# Altium schematic sheet Main.SchDoc
size A3; SheetNumber: 1; SheetTotal: 7
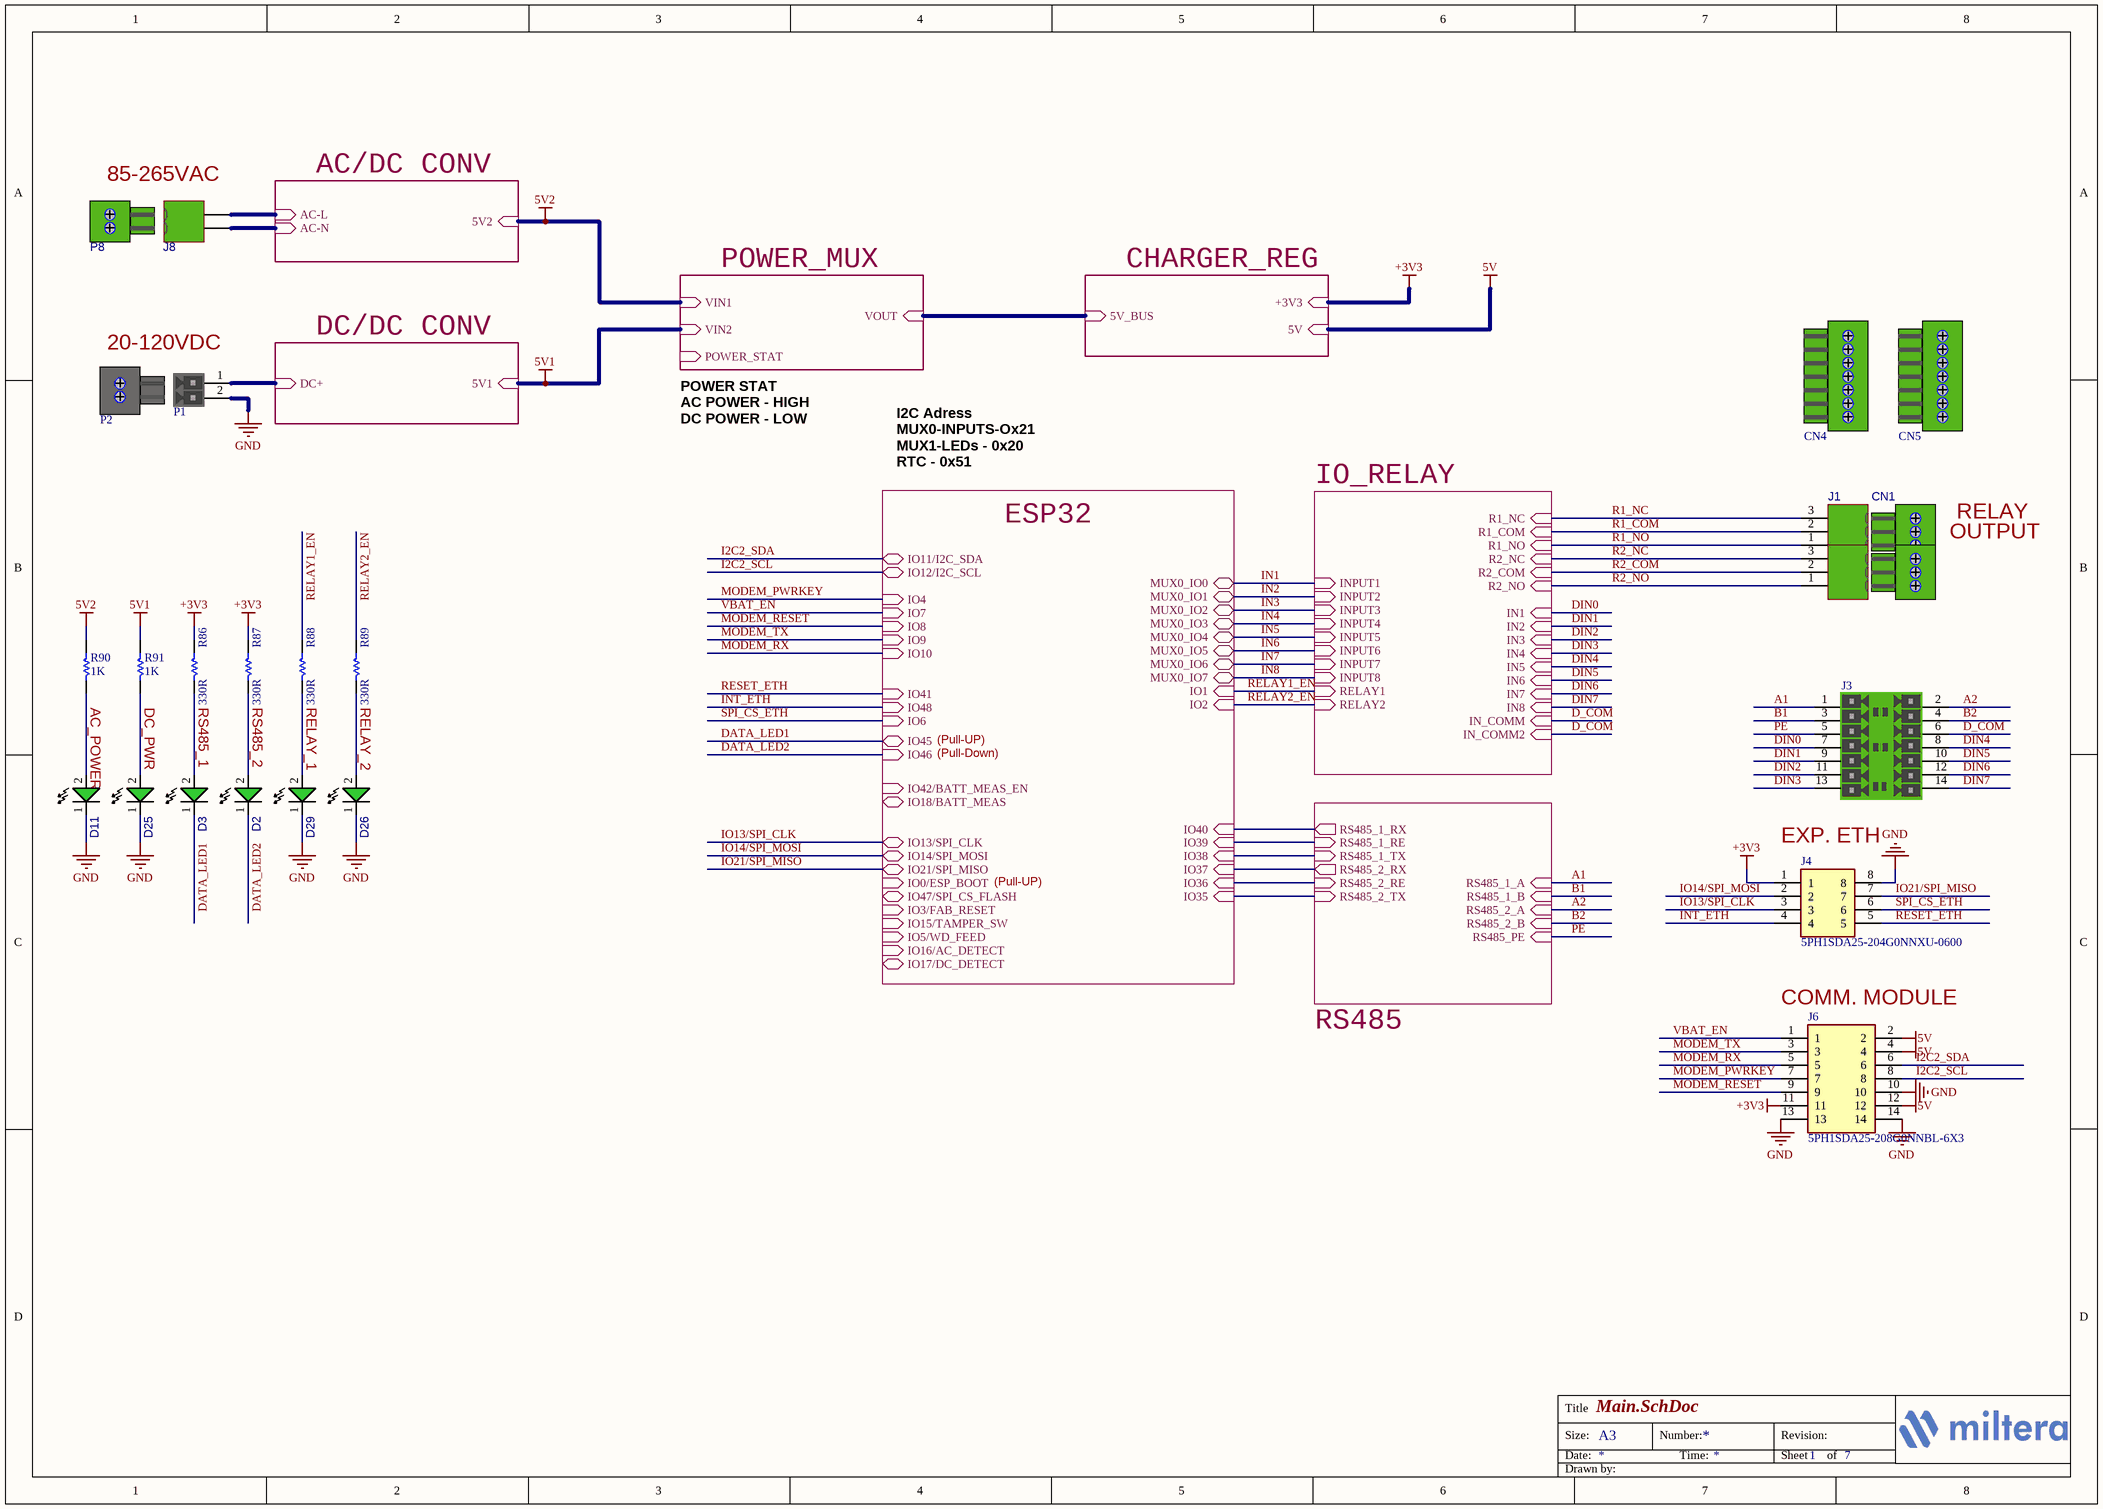
[diagram p0: Main.SchDoc]

## Parts
CN1  2EDGK-5.08-06P-14-00AH  [2EDGK-5.08-06P-14-00AH]  (value not drawn)  (mechanical)
CN2  2EDGRC-5.08-03P-14-00SH  [2EDGRC-5.08-03P-14-00SH]  (value not drawn)  (no BOM)
CN3  2EDGK-5.08-03P-14-00AH  [2EDGK-5.08-06P-14-00AH]  (value not drawn)  (no BOM)
CN4  15EDGK-3.81-07P-14-00AH  [15EDGK-3.81-07P]  (value not drawn)
CN5  15EDGK-3.81-07P-14-00AH  [15EDGK-3.81-07P]  (value not drawn)
D2  PSC-1608U52GC-G4  [LED_0603_GRN]  (value not drawn)
D3  PSC-1608U52GC-G4  [LED_0603_GRN]  (value not drawn)
D11  PSC-1608U52GC-G4  [LED_0603_GRN]  (value not drawn)
D25  PSC-1608U52GC-G4  [LED_0603_GRN]  (value not drawn)
D26  PSC-1608U52GC-G4  [LED_0603_GRN]  (value not drawn)
D29  PSC-1608U52GC-G4  [LED_0603_GRN]  (value not drawn)
J1  2EDGRC-5.08-06P-14-00SH  [2EDGRC-5.08-03P-14-00SH]  (value not drawn)
J3  15EDGRH-3.81-12P-14-00AH  [15EDGRH-3.81-14P]  (value not drawn)
J4  5PH1SDA25-204G0NNXU-0600  [61300821121]
J6  5PH1SDA25-208G0NNBL-6X3  [HDRV14W64P254_2X7_1778X508X854P]
J8  2EDGRC-5.08-02P-14-00AH  [2EDGRC-5.08-02P]  (value not drawn)
P1  15EDGRC-3.5-02P-11-00AH  [15EDGRC-3.5-02P-11-00AH]  (value not drawn)
P2  15EDGK-3.5-02P-11-00AH  [15EDGK-3.5-02P-11-00AH]  (value not drawn)
P8  2EDGK-5.08-02P-14-00AH  [2EDGK-5.08-02P]  (value not drawn)
R86  value 330R  [RES_0603]  (hidden comment: RES)
R87  value 330R  [RES_0603]  (hidden comment: RES)
R88  value 330R  [RES_0603]  (hidden comment: RES)
R89  value 330R  [RES_0603]  (hidden comment: RES)
R90  value 1K  [RES_0603]  (hidden comment: RES)
R91  value 1K  [RES_0603]  (hidden comment: RES)

## Sub-sheets
AC/DC CONV = ACDC.SchDoc: AC-L (in), AC-N (in), 5V2 (in)
CHARGER_REG = Charger_S.CAP_BAT.SchDoc: 5V_BUS (in), +3V3 (in), 5V (in)
DC/DC CONV = DC_EXT.SchDoc: DC+ (in), 5V1 (in)
ESP32 = ESP32.SchDoc: IO35 (in), IO36 (in), IO37 (in), IO38 (in), IO39 (in), IO40 (in), IO11/I2C_SDA (bidir), IO12/I2C_SCL (bidir), IO16/AC_DETECT (in), IO15/TAMPER_SW (in), IO5/WD_FEED (in), IO3/FAB_RESET (in), IO0/ESP_BOOT (in), IO47/SPI_CS_FLASH (bidir), IO13/SPI_CLK (bidir), IO14/SPI_MOSI (bidir), IO21/SPI_MISO (bidir), IO1 (in), IO2 (in), IO42/BATT_MEAS_EN (in), IO41 (in), IO48 (in), IO10 (in), IO9 (in), IO46 (in), IO8 (in), IO7 (in), IO4 (in), IO17/DC_DETECT (bidir), IO18/BATT_MEAS (bidir), IO6 (in), MUX0_IO0 (bidir), MUX0_IO1 (bidir), MUX0_IO2 (bidir), MUX0_IO3 (bidir), MUX0_IO4 (bidir), MUX0_IO5 (bidir), MUX0_IO6 (bidir), MUX0_IO7 (bidir), IO45 (bidir)
IO_RELAY = IO.SchDoc: INPUT1 (in), INPUT2 (in), INPUT3 (in), INPUT4 (in), RELAY1 (in), RELAY2 (in), R1_COM (in), R1_NO (in), R2_COM (in), R2_NO (in), R1_NC (in), R2_NC (in), IN1 (in), IN2 (in), IN3 (in), IN4 (in), IN_COMM (in), IN5 (in), IN6 (in), IN7 (in), IN8 (in), IN_COMM2 (in), INPUT5 (in), INPUT6 (in), INPUT7 (in), INPUT8 (in)
POWER_MUX = POWER_MUX.SchDoc: VIN1 (in), VIN2 (in), VOUT (in), POWER_STAT (in)
RS485 = RS485.SchDoc: RS485_1_B (in), RS485_1_A (in), RS485_2_B (in), RS485_2_A (in), RS485_1_RX (out), RS485_1_RE (in), RS485_1_TX (in), RS485_2_RX (out), RS485_2_RE (in), RS485_2_TX (in), RS485_PE (in)

## Nets
5V: J6.2 J6.4 J6.12 ; sheet CHARGER_REG/5V
5V1: R91.1 ; sheet DC/DC CONV/5V1, sheet POWER_MUX/VIN2
5V2: R90.1 ; sheet AC/DC CONV/5V2, sheet POWER_MUX/VIN1
+3V3: J4.1 J6.11 R86.1 R87.1 ; sheet CHARGER_REG/+3V3
GND: D11.1 D25.1 D26.1 D29.1 J4.8 J6.10 J6.13 J6.14 P1.2
A1: J3.1 ; sheet RS485/RS485_1_A
A2: J3.2 ; sheet RS485/RS485_2_A
B1: J3.3 ; sheet RS485/RS485_1_B
B2: J3.4 ; sheet RS485/RS485_2_B
D_COM: J3.6 ; sheet IO_RELAY/IN_COMM, sheet IO_RELAY/IN_COMM2
DATA_LED1: D3.1 ; sheet ESP32/IO45
DATA_LED2: D2.1 ; sheet ESP32/IO46
DIN0: J3.7 ; sheet IO_RELAY/IN1
DIN1: J3.9 ; sheet IO_RELAY/IN2
DIN2: J3.11 ; sheet IO_RELAY/IN3
DIN3: J3.13 ; sheet IO_RELAY/IN4
DIN4: J3.8 ; sheet IO_RELAY/IN5
DIN5: J3.10 ; sheet IO_RELAY/IN6
DIN6: J3.12 ; sheet IO_RELAY/IN7
DIN7: J3.14 ; sheet IO_RELAY/IN8
I2C2_SCL: J6.8 ; sheet ESP32/IO12/I2C_SCL
I2C2_SDA: J6.6 ; sheet ESP32/IO11/I2C_SDA
IN1: sheet ESP32/MUX0_IO0, sheet IO_RELAY/INPUT1
IN2: sheet ESP32/MUX0_IO1, sheet IO_RELAY/INPUT2
IN3: sheet ESP32/MUX0_IO2, sheet IO_RELAY/INPUT3
IN4: sheet ESP32/MUX0_IO3, sheet IO_RELAY/INPUT4
IN5: sheet ESP32/MUX0_IO4, sheet IO_RELAY/INPUT5
IN6: sheet ESP32/MUX0_IO5, sheet IO_RELAY/INPUT6
IN7: sheet ESP32/MUX0_IO6, sheet IO_RELAY/INPUT7
IN8: sheet ESP32/MUX0_IO7, sheet IO_RELAY/INPUT8
INT_ETH: J4.4 ; sheet ESP32/IO48
IO13/SPI_CLK: J4.3 ; sheet ESP32/IO13/SPI_CLK
IO14/SPI_MOSI: J4.2 ; sheet ESP32/IO14/SPI_MOSI
IO21/SPI_MISO: J4.7 ; sheet ESP32/IO21/SPI_MISO
MODEM_PWRKEY: J6.7 ; sheet ESP32/IO4
MODEM_RESET: J6.9 ; sheet ESP32/IO8
MODEM_RX: J6.5 ; sheet ESP32/IO10
MODEM_TX: J6.3 ; sheet ESP32/IO9
PE: J3.5 ; sheet RS485/RS485_PE
R1_COM: J1.2 ; sheet IO_RELAY/R1_COM
R1_NC: J1.3 ; sheet IO_RELAY/R1_NC
R1_NO: J1.1 ; sheet IO_RELAY/R1_NO
R2_COM: CN2.2 ; sheet IO_RELAY/R2_COM
R2_NC: CN2.3 ; sheet IO_RELAY/R2_NC
R2_NO: CN2.1 ; sheet IO_RELAY/R2_NO
RELAY1_EN: R88.1 ; sheet ESP32/IO1, sheet IO_RELAY/RELAY1
RELAY2_EN: R89.1 ; sheet ESP32/IO2, sheet IO_RELAY/RELAY2
RESET_ETH: J4.5 ; sheet ESP32/IO41
SPI_CS_ETH: J4.6 ; sheet ESP32/IO6
VBAT_EN: J6.1 ; sheet ESP32/IO7
NetD2_2: D2.2 R87.2
NetD3_2: D3.2 R86.2
NetD11_2: D11.2 R90.2
NetD25_2: D25.2 R91.2
NetD26_2: D26.2 R89.2
NetD29_2: D29.2 R88.2
NetJ8_1: J8.1 ; sheet AC/DC CONV/AC-L
NetJ8_2: J8.2 ; sheet AC/DC CONV/AC-N
NetP1_1: P1.1 ; sheet DC/DC CONV/DC+
(unnamed): sheet ESP32/IO35, sheet RS485/RS485_2_TX
(unnamed): sheet ESP32/IO36, sheet RS485/RS485_2_RE
(unnamed): sheet ESP32/IO37, sheet RS485/RS485_2_RX
(unnamed): sheet ESP32/IO38, sheet RS485/RS485_1_TX
(unnamed): sheet ESP32/IO39, sheet RS485/RS485_1_RE
(unnamed): sheet ESP32/IO40, sheet RS485/RS485_1_RX
(unnamed): sheet POWER_MUX/VOUT, sheet CHARGER_REG/5V_BUS

## Notes on the sheet
- (near J8) 85-265VAC
- (near P1) 20-120VDC
- POWER STAT
  AC POWER - HIGH
  DC POWER - LOW
- I2C Adress
  MUX0-INPUTS-Ox21
  MUX1-LEDs - 0x20
  RTC - 0x51
- OUTPUT
- RELAY
- AC_POWER
- DC_PWR
- RS485_1
- RS485_2
- RELAY_1
- RELAY_2
- (Pull-Down)
- (Pull-UP)
- EXP. ETH
- (near J6) COMM. MODULE
- Title
- Size:
- Date:
- A3
- Number:
- Time:
- Revision:
- Sheet
- of
- Drawn by:

## Library data of the parts
CN1 = 2EDGK-5.08-03P-14-00AH: TERM.BLK.5.08MM 6P FEMALE GREEN; Manufacturer: DEGSON; Manufacturer Part Number: 2EDGK-5.08-06P-14-00AH; Value: 2EDGK-5.08-06P-14-00AH
CN2 = 2EDGRC-5.08-03P-14-00SH: TERM.BLK.5.08MM 3P 90C MALE GREEN CLOSED; Manufacturer: GAOSONG; Package: *; Manufacturer Part Number: 2EDGRC-5.08-03P-14-00SH; Value: 2EDGRC-5.08-03P-14-00SH
CN3 = 2EDGK-5.08-03P-14-00AH: TERM.BLK.5.08MM 3P FEMALE GREEN; Manufacturer: DEGSON; Package: *; Manufacturer Part Number: 2EDGK-5.08-03P-14-00AH; Value: 2EDGK-5.08-03P-14-00AH
CN4 CN5 = 15EDGK-3.81-07P-14-00AH: TERM.BLK.3.81MM 7P FEMALE GREEN; Manufacturer: DEGSON; Value: 3.81m 07P; Manufacturer Part Number: 15EDGK-3.81-07P-14-00AH
D2 D3 D11 D25 D26 D29 = LTST-C190TGKT: LED GREEN WATER CLEAR 0603 SMD; Manufacturer: HONGLITRONIC; Package: 0603(1608 Metric); Manufacturer Part Number: PSC-1608U52GC-G4; Value: GREEN
J1 = 2EDGRC-5.08-03P-14-00SH: TERM.BLK.5.08MM 6P 90C MALE GREEN CLOSED; Manufacturer: DEGSON; Manufacturer Part Number: 2EDGRC-5.08-06P-14-00SH; Value: 2EDGRC-5.08-06P-14-00SH
J3 = 15EDGRH-3.81-12P-14-00AH: TERM.BLK.3.81mm 14P 90C MALE GREEN CLOSED; Manufacturer: DEGSON; Value: 3.81mm 14P; Manufacturer Part Number: 15EDGRH-3.81-12P-14-00AH
J4 = 61300821121: MALE HEADER 8PIN(2X4) 2.54MM THT 6X3MM; Manufacturer: AMTEK; Manufacturer Part Number: 5PH1SDA25-204G0NNXU-0600
J6 = 61301421121: PIN HEADER 16PIN(2x8) 2.54mm THT V/T; Manufacturer: AMTEK; Manufacturer Part Number: 5PH1SDA25-208G0NNBL-6X3
J8 = 2EDGRC-5.08-02P-14-00AH: TERM.BLK.5.08MM 2P 90C MALE GREEN CLOSED; Manufacturer: DEGSON; Manufacturer Part Number: 2EDGRC-5.08-02P-14-00AH
P1 = 15EDGRC-3.5-02P-11-00AH: TERM.BLK.3.50MM 2P 90C MALE GRAY CLOSED; Manufacturer: DEGSON; Value: 3.5mm 02P; Manufacturer Part Number: 15EDGRC-3.5-02P-11-00AH
P2 = 15EDGK-3.5-02P-11-00AH: TERM.BLK.3.50MM 2P FEMALE GRAY; Manufacturer: DEGSON; Value: 3.5mm 02P; Manufacturer Part Number: 15EDGK-3.5-02P-11-00AH
P8 = 2EDGK-5.08-02P-14-00AH: TERM.BLK.5.08MM 2P FEMALE GREEN; Manufacturer: DEGSON; Manufacturer Part Number: 2EDGK-5.08-02P-14-00AH
R86-R89 = R03005: RES 0603 330 Ohms 1% 1/10W-S 100PPM; Manufacturer: ROYALOHM; Manufacturer Part Number: 0603SAF3300T5E
R90 R91 = R02998: RES 0603 1K Ohms 1% 1/10W-S 100PPM; Manufacturer: ROYALOHM; Manufacturer Part Number: 0603SAF1001T5E